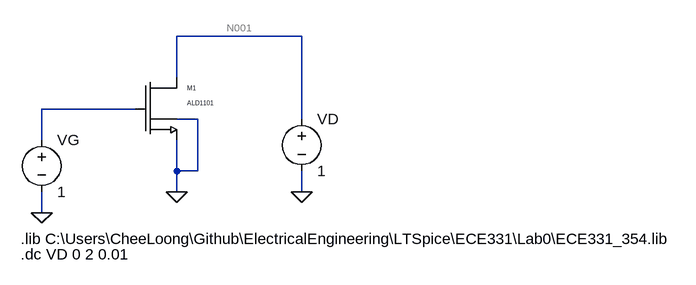
[diagram p0: schematic sample.asc]
sample.asc, the LTspice schematic file:
Version 4
SHEET 1 1120 680
WIRE 352 48 160 48
WIRE 160 112 160 48
WIRE 96 160 -48 160
WIRE 192 176 160 176
WIRE 352 176 352 48
WIRE -48 208 -48 160
WIRE 160 256 160 208
WIRE 192 256 192 176
WIRE 192 256 160 256
WIRE 160 288 160 256
WIRE 352 288 352 256
WIRE -48 320 -48 288
FLAG 160 288 0
FLAG -48 320 0
FLAG 352 288 0
SYMBOL ALD1101 96 112 R0
SYMATTR InstName M1
SYMBOL voltage -48 192 R0
WINDOW 123 0 0 Left 2
WINDOW 39 0 0 Left 2
SYMATTR InstName VG
SYMATTR Value 1
SYMBOL voltage 352 160 R0
WINDOW 123 0 0 Left 2
WINDOW 39 0 0 Left 2
SYMATTR InstName VD
SYMATTR Value 1
TEXT -80 360 Left 2 !.lib C:\\Users\\CheeLoong\\Github\\ElectricalEngineering\\LTSpice\\ECE331\\Lab0\\ECE331_354.lib
TEXT -80 384 Left 2 !.dc VD 0 2 0.01

The netlist it stands for:
* sample.asc
M1 N001 N002 0 0 ALD1101 W=1.379e-3 L=1E-6
VG N002 0 1
VD N001 0 1
.model NMOS NMOS
.model PMOS PMOS
.lib standard.mos
.lib C:\Users\CheeLoong\Github\ElectricalEngineering\LTSpice\ECE331\Lab0\ECE331_354.lib
.dc VD 0 2 0.01
.backanno
.end

* Results of the author's LTspice run, read from the files saved beside the schematic
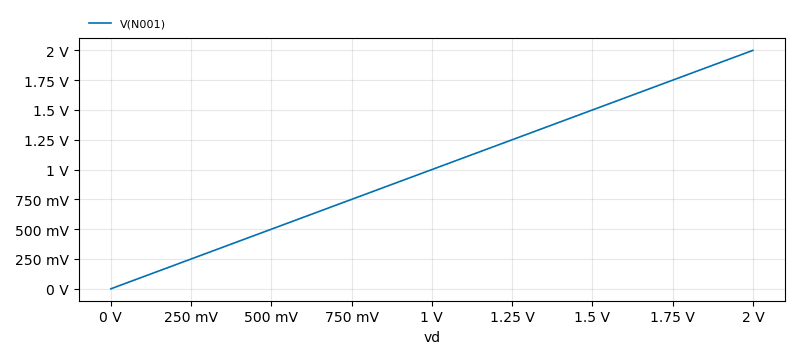
[diagram p1: DC transfer characteristic of sample.asc, plotted from the saved traces]
* DC transfer characteristic, 1 run:
*   V(N001): 0 V at vd=0 V, 2 V at vd=2 V, min 0 V, max 2 V